# Altium schematic sheet 03_CONNECTOR.SchDoc: =TitleParameter
size A3; Organization: ASISGUARD; Address1: Kemalpasa, Kemalpasa Cd. No:290 D:292H, 35060 Bornova/Izmir/Turkey; SheetNumber: 3; SheetTotal: 8
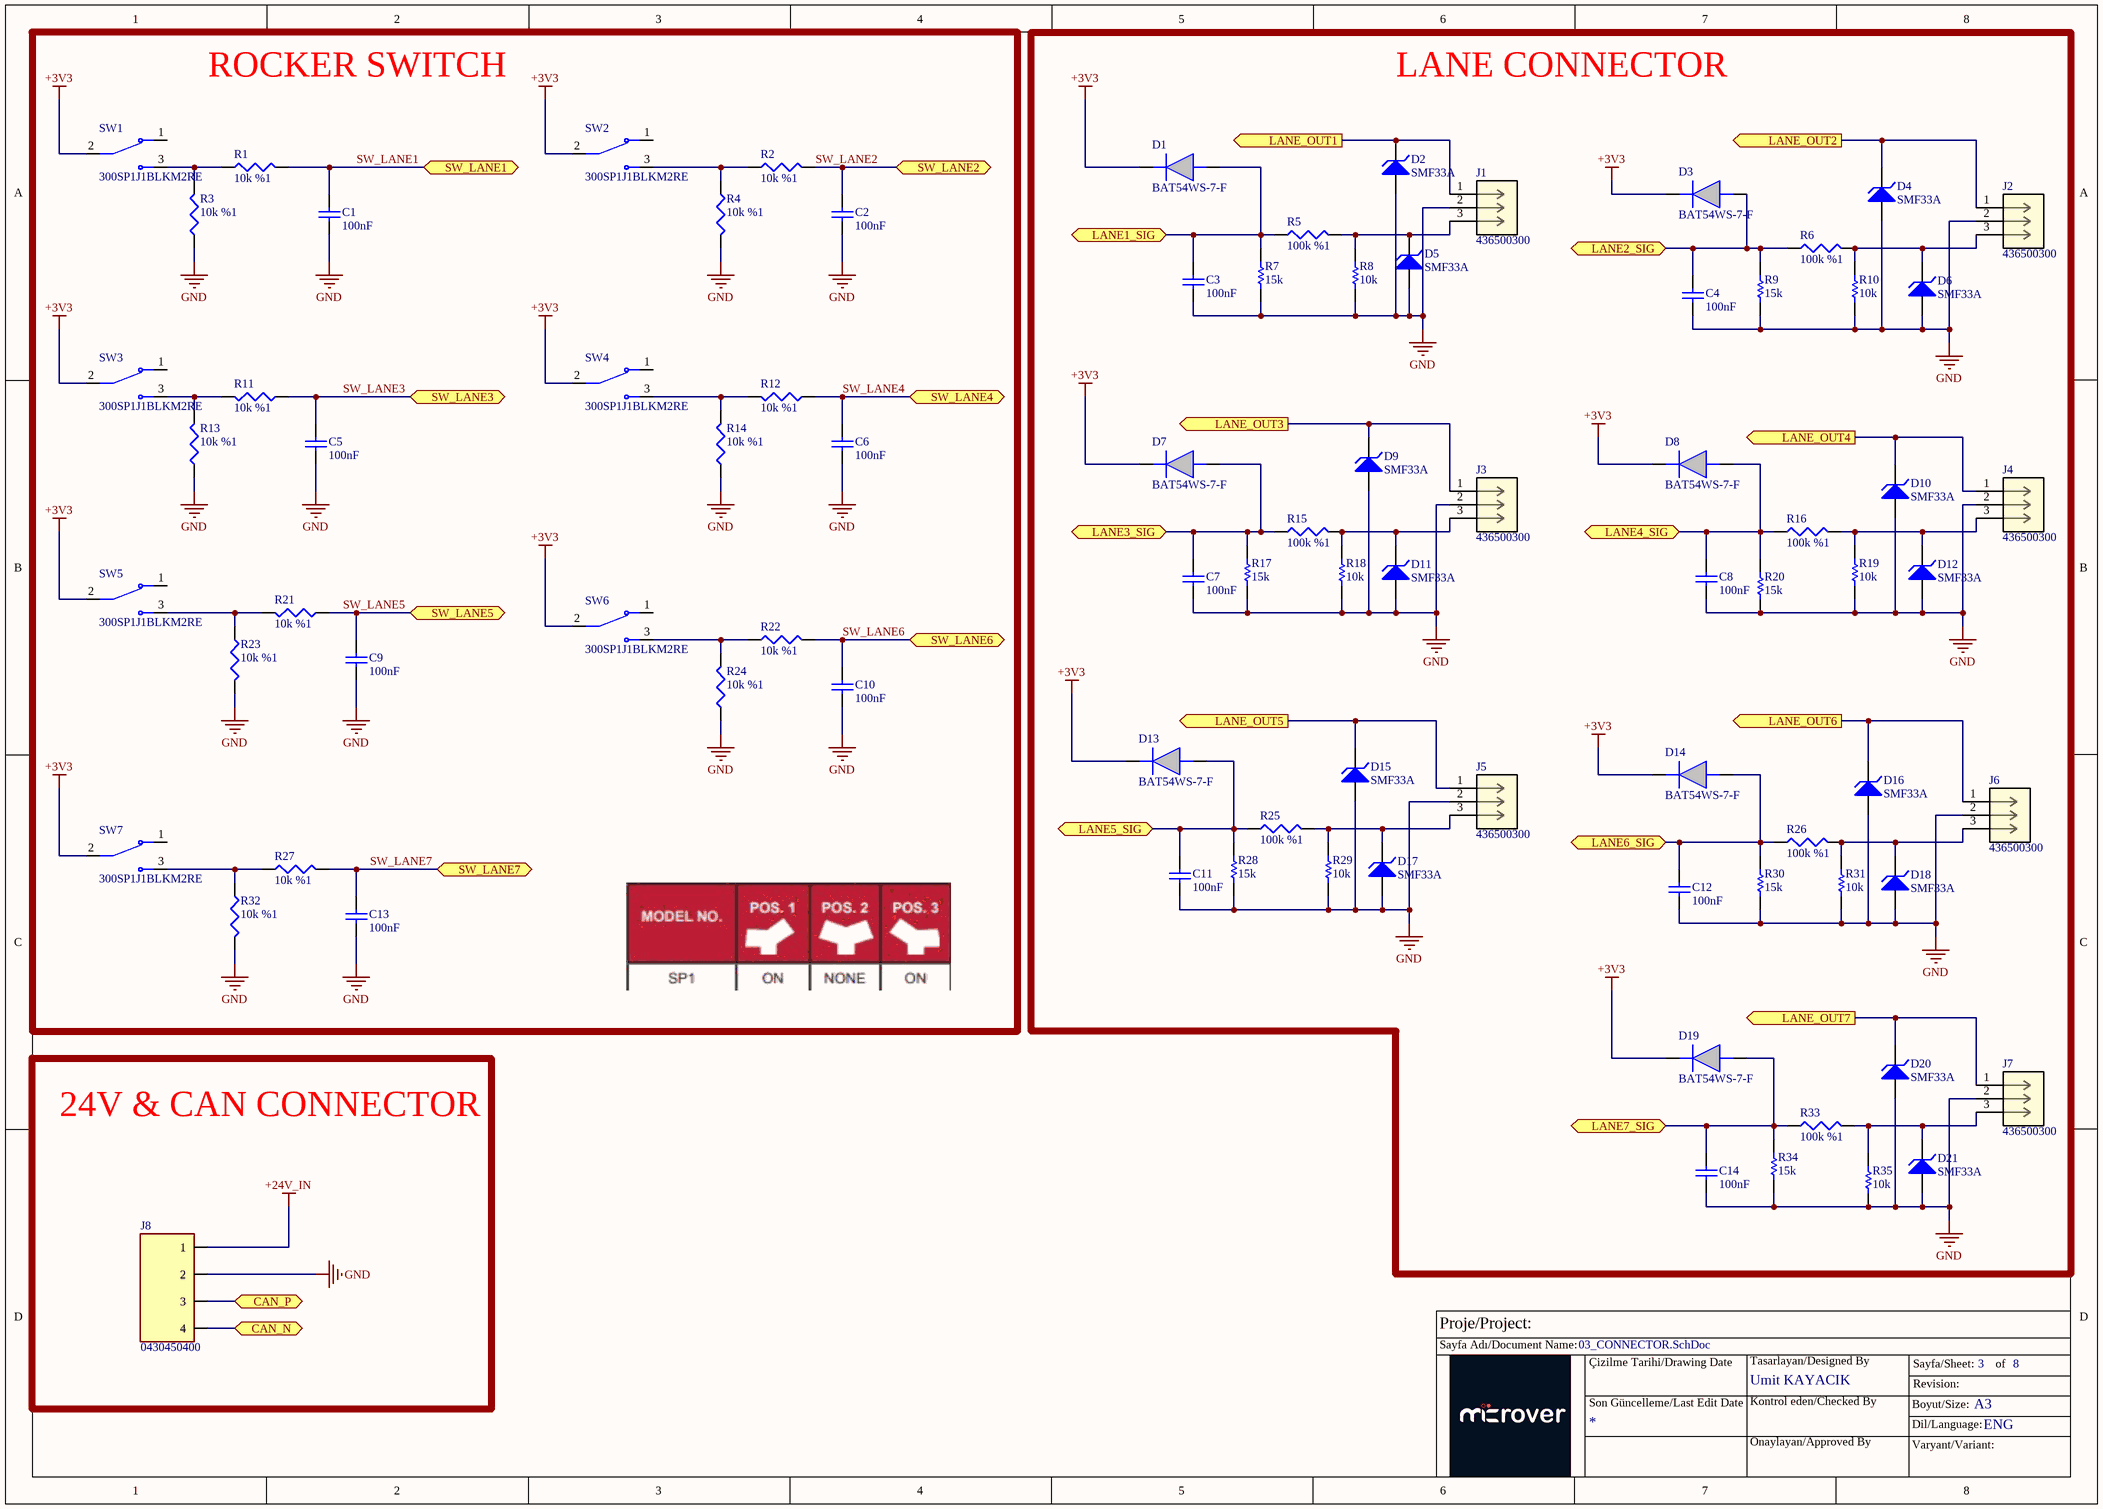
[diagram p0: 03_CONNECTOR.SchDoc]

## Parts
C1  100nF  [CAP0603]
C2  100nF  [CAP0603]
C3  100nF  [CAP0603]
C4  100nF  [CAP0603]
C5  100nF  [CAP0603]
C6  100nF  [CAP0603]
C7  100nF  [CAP0603]
C8  100nF  [CAP0603]
C9  100nF  [CAP0603]
C10  100nF  [CAP0603]
C11  100nF  [CAP0603]
C12  100nF  [CAP0603]
C13  100nF  [CAP0603]
C14  100nF  [CAP0603]
D1  BAT54WS-7-F  [SOD2513X120N]
D2  SMF33A  [SOD-123F - duplicate]
D3  BAT54WS-7-F  [SOD2513X120N]
D4  SMF33A  [SOD-123F - duplicate]
D5  SMF33A  [SOD-123F - duplicate]
D6  SMF33A  [SOD-123F - duplicate]
D7  BAT54WS-7-F  [SOD2513X120N]
D8  BAT54WS-7-F  [SOD2513X120N]
D9  SMF33A  [SOD-123F - duplicate]
D10  SMF33A  [SOD-123F - duplicate]
D11  SMF33A  [SOD-123F - duplicate]
D12  SMF33A  [SOD-123F - duplicate]
D13  BAT54WS-7-F  [SOD2513X120N]
D14  BAT54WS-7-F  [SOD2513X120N]
D15  SMF33A  [SOD-123F - duplicate]
D16  SMF33A  [SOD-123F - duplicate]
D17  SMF33A  [SOD-123F - duplicate]
D18  SMF33A  [SOD-123F - duplicate]
D19  BAT54WS-7-F  [SOD2513X120N]
D20  SMF33A  [SOD-123F - duplicate]
D21  SMF33A  [SOD-123F - duplicate]
J1  436500300  [CONN_SD-43650-001_03_MOL/]
J2  436500300  [CONN_SD-43650-001_03_MOL/]
J3  436500300  [CONN_SD-43650-001_03_MOL/]
J4  436500300  [CONN_SD-43650-001_03_MOL/]
J5  436500300  [CONN_SD-43650-001_03_MOL/]
J6  436500300  [CONN_SD-43650-001_03_MOL/]
J7  436500300  [CONN_SD-43650-001_03_MOL/]
J8  0430450400  [CONN_SD-43045-001_04_MOL]
R1  10k %1  [RESIS_0603]
R2  10k %1  [RESIS_0603]
R3  10k %1  [RESIS_0603]
R4  10k %1  [RESIS_0603]
R5  100k %1  [RESIS_0603]
R6  100k %1  [RESIS_0603]
R7  15k  [RESIS_0603]
R8  10k  [RES0805]
R9  15k  [RESIS_0603]
R10  10k  [RES0805]
R11  10k %1  [RESIS_0603]
R12  10k %1  [RESIS_0603]
R13  10k %1  [RESIS_0603]
R14  10k %1  [RESIS_0603]
R15  100k %1  [RESIS_0603]
R16  100k %1  [RESIS_0603]
R17  15k  [RESIS_0603]
R18  10k  [RES0805]
R19  10k  [RES0805]
R20  15k  [RESIS_0603]
R21  10k %1  [RESIS_0603]
R22  10k %1  [RESIS_0603]
R23  10k %1  [RESIS_0603]
R24  10k %1  [RESIS_0603]
R25  100k %1  [RESIS_0603]
R26  100k %1  [RESIS_0603]
R27  10k %1  [RESIS_0603]
R28  15k  [RESIS_0603]
R29  10k  [RES0805]
R30  15k  [RESIS_0603]
R31  10k  [RES0805]
R32  10k %1  [RESIS_0603]
R33  100k %1  [RESIS_0603]
R34  15k  [RESIS_0603]
R35  10k  [RES0805]
SW1  300SP1J1BLKM2RE  [sw_300SP1J1BLKM2RE_]
SW2  300SP1J1BLKM2RE  [sw_300SP1J1BLKM2RE_]
SW3  300SP1J1BLKM2RE  [sw_300SP1J1BLKM2RE_]
SW4  300SP1J1BLKM2RE  [sw_300SP1J1BLKM2RE_]
SW5  300SP1J1BLKM2RE  [sw_300SP1J1BLKM2RE_]
SW6  300SP1J1BLKM2RE  [sw_300SP1J1BLKM2RE_]
SW7  300SP1J1BLKM2RE  [sw_300SP1J1BLKM2RE_]

## Blocks framed on the sheet
ROCKER SWITCH: C1 C2 C5 C6 C9 C10 C13 R1-R4 R11-R14 R21-R24 R27 R32 SW1-SW7
LANE CONNECTOR: C3 C4 C7 C8 C11 C12 C14 D1-D21 J1-J7 R5-R10 R15-R20 R25 R26 R28-R31 R33-R35
24V & CAN CONNECTOR: J8

## Ports
CAN_N (bidir), CAN_P (bidir), LANE1_SIG (bidir), LANE2_SIG (bidir), LANE3_SIG (bidir), LANE4_SIG (bidir), LANE5_SIG (bidir), LANE6_SIG (bidir), LANE7_SIG (bidir), LANE_OUT1 (out), LANE_OUT2 (out), LANE_OUT3 (out), LANE_OUT4 (out), LANE_OUT5 (out), LANE_OUT6 (out), LANE_OUT7 (out), SW_LANE1 (bidir), SW_LANE2 (bidir), SW_LANE3 (bidir), SW_LANE4 (bidir), SW_LANE5 (bidir), SW_LANE6 (bidir), SW_LANE7 (bidir)

## Nets
+3V3: D1.1(K) D3.1(K) D7.1(K) D8.1(K) D13.1(K) D14.1(K) D19.1(K) SW1.2 SW2.2 SW3.2 SW4.2 SW5.2 SW6.2 SW7.2
+24V_IN: J8.1
GND: C1.1 C2.1 C3.1 C4.1 C5.1 C6.1 C7.1 C8.1 C9.1 C10.1 C11.1 C12.1 C13.1 C14.1 D2.2(A) D4.2(A) D5.2(A) D6.2(A) D9.2(A) D10.2(A) D11.2(A) D12.2(A) D15.2(A) D16.2(A) D17.2(A) D18.2(A) D20.2(A) D21.2(A) J1.2 J2.2 J3.2 J4.2 J5.2 J6.2 J7.2 J8.2 R3.1 R4.2 R7.1 R8.1 R9.1 R10.1 R13.1 R14.1 R17.1 R18.1 R19.1 R20.1 R23.2 R24.1 R28.1 R29.1 R30.1 R31.1 R32.2 R34.1 R35.1
CAN_N: J8.4 ; port CAN_N
CAN_P: J8.3 ; port CAN_P
LANE1_SIG: C3.2 D1.2(A) R5.1 R7.2 ; port LANE1_SIG
LANE2_SIG: C4.2 D3.2(A) R6.1 R9.2 ; port LANE2_SIG
LANE3_SIG: C7.2 D7.2(A) R15.1 R17.2 ; port LANE3_SIG
LANE4_SIG: C8.2 D8.2(A) R16.1 R20.2 ; port LANE4_SIG
LANE5_SIG: C11.2 D13.2(A) R25.1 R28.2 ; port LANE5_SIG
LANE6_SIG: C12.2 D14.2(A) R26.1 R30.2 ; port LANE6_SIG
LANE7_SIG: C14.2 D19.2(A) R33.1 R34.2 ; port LANE7_SIG
LANE_OUT1: D2.1(K) J1.1 ; port LANE_OUT1
LANE_OUT2: D4.1(K) J2.1 ; port LANE_OUT2
LANE_OUT3: D9.1(K) J3.1 ; port LANE_OUT3
LANE_OUT4: D10.1(K) J4.1 ; port LANE_OUT4
LANE_OUT5: D15.1(K) J5.1 ; port LANE_OUT5
LANE_OUT6: D16.1(K) J6.1 ; port LANE_OUT6
LANE_OUT7: D20.1(K) J7.1 ; port LANE_OUT7
SW_LANE1: C1.2 R1.2 ; port SW_LANE1
SW_LANE2: C2.2 R2.2 ; port SW_LANE2
SW_LANE3: C5.2 R11.1 ; port SW_LANE3
SW_LANE4: C6.2 R12.1 ; port SW_LANE4
SW_LANE5: C9.2 R21.1 ; port SW_LANE5
SW_LANE6: C10.2 R22.2 ; port SW_LANE6
SW_LANE7: C13.2 R27.2 ; port SW_LANE7
NetD5_1: D5.1(K) J1.3 R5.2 R8.2
NetD6_1: D6.1(K) J2.3 R6.2 R10.2
NetD11_1: D11.1(K) J3.3 R15.2 R18.2
NetD12_1: D12.1(K) J4.3 R16.2 R19.2
NetD17_1: D17.1(K) J5.3 R25.2 R29.2
NetD18_1: D18.1(K) J6.3 R26.2 R31.2
NetD21_1: D21.1(K) J7.3 R33.2 R35.2
NetR1_1: R1.1 R3.2 SW1.3
NetR2_1: R2.1 R4.1 SW2.3
NetR11_2: R11.2 R13.2 SW3.3
NetR12_2: R12.2 R14.2 SW4.3
NetR21_2: R21.2 R23.1 SW5.3
NetR22_1: R22.1 R24.2 SW6.3
NetR27_1: R27.1 R32.1 SW7.3

Not connected (* = marked no-connect by the designer): SW1 1; SW2 1; SW3 1; SW4 1; SW5 1; SW6 1; SW7 1

## Notes on the sheet
- Proje/Project:
- Sayfa Adı/Document Name:
- Çizilme Tarihi/Drawing Date
- Umit KAYACIK
- Tasarlayan/Designed By
- Sayfa/Sheet:
- Revision:
- of
- Son Güncelleme/Last Edit Date
- Kontrol eden/Checked By
- Onaylayan/Approved By
- Boyut/Size:
- Varyant/Variant:
- Dil/Language:
- A3
- ENG

## Library data of the parts
C1-C14 = CAP0603_100nF_50V: 0.1 µF ±10% 50V Ceramic Capacitor X7R 0603 (1608 Metric); Manufacturer Name: KEMET; Manufacturer Part Number: C0603C104K5RAC7867; Datasheet Link: https://componentsearchengine.com/Datasheets/1/06031A100FAT2A.pdf; Height: 0.9mm
D1 D3 D7 D8 D13 D14 D19 = BAT54WS-7-F: Diode 30 V 100mA Surface Mount SOD-323; MPN: BAT54WS-7-F; Supplier: C124205
D2 D4-D6 D9-D12 D15-D18 D20 D21 = SMF33A: 53.3V Clamp 3.8A Ipp Tvs Diode Surface Mount SOD-123F; Manufacturer: Littelfuse Inc.; MPN: SMF33A
J1-J7 = 436500300: Micro-Fit 3.0 Right-Angle Header, 3.00mm Pitch, Single Row, 3 Circuits, with Snap-in Plastic Peg PCB Lock, Tin, Glow-Wire Capable, Black; Manufacturer Part Number: 436500300; Supplier: Digi; WM1861-ND
J8 = 0430450400: Connector Header Through Hole, Right Angle 4 position 0.118" (3.00mm); Manufacturer: MOLEX; Manufacturer Part Number: 0430450400; Supplier: Digi; WM1814-ND
R1-R4 R11-R14 R21-R24 R27 R32 = 0603WAF1002T5E: Thick Film Resistors - SMD 0603 100 mW (1/10 W) 1% 10K; Manufacturer: UNI-ROYAL(Uniroyal Elec); Supplier_JLCPCB: C25804; Supplier_MOUSER: 303-0603WAF1002T5E
R5 R6 R15 R16 R25 R26 R33 = 0603WAF1003T5E: -55℃~+155℃ 100kΩ 100mW 75V Thick Film Resistor ±1% ±100ppm/℃ 0603 Chip Resistor - Surface Mount ROHS; Manufacturer: UNI-ROYAL(Uniroyal Elec); Supplier_JLCPCB: C25803; Supplier_MOUSER: 303-0603WAF1003T5E
R7 R9 R17 R20 R28 R30 R34 = 0603WAF1502T5E: -55℃~+155℃ 100mW 15kΩ 75V Thick Film Resistor ±1% ±100ppm/℃ 0603 Chip Resistor - Surface Mount ROHS; Manufacturer: UNI-ROYAL(Uniroyal Elec); JLCPCB PART 3: C22809; Mouser Part Number: 303-0603WAF1502T5E
R8 R10 R18 R19 R29 R31 R35 = 0805W8F1002T5E: -55℃~+155℃ 10kΩ 125mW 150V Thick Film Resistor ±1% ±100ppm/℃ 0805 Chip Resistor - Surface Mount ROHS; Manufacturer: UNI-ROYAL(Uniroyal Elec); JLCPCB PART#: C17414
SW1-SW7 = 300SP1J1BLKM2RE: Rocker Switch SPDT 0.4VA (AC/DC) 20 V Through Hole; Manufacturer: E-Switch; MPN: 300SP1J1BLKM2RE; Supplier: Dıgı; EG4312-ND